# EAGLE design sensorHubRev6 (EAGLE 9.2.2)
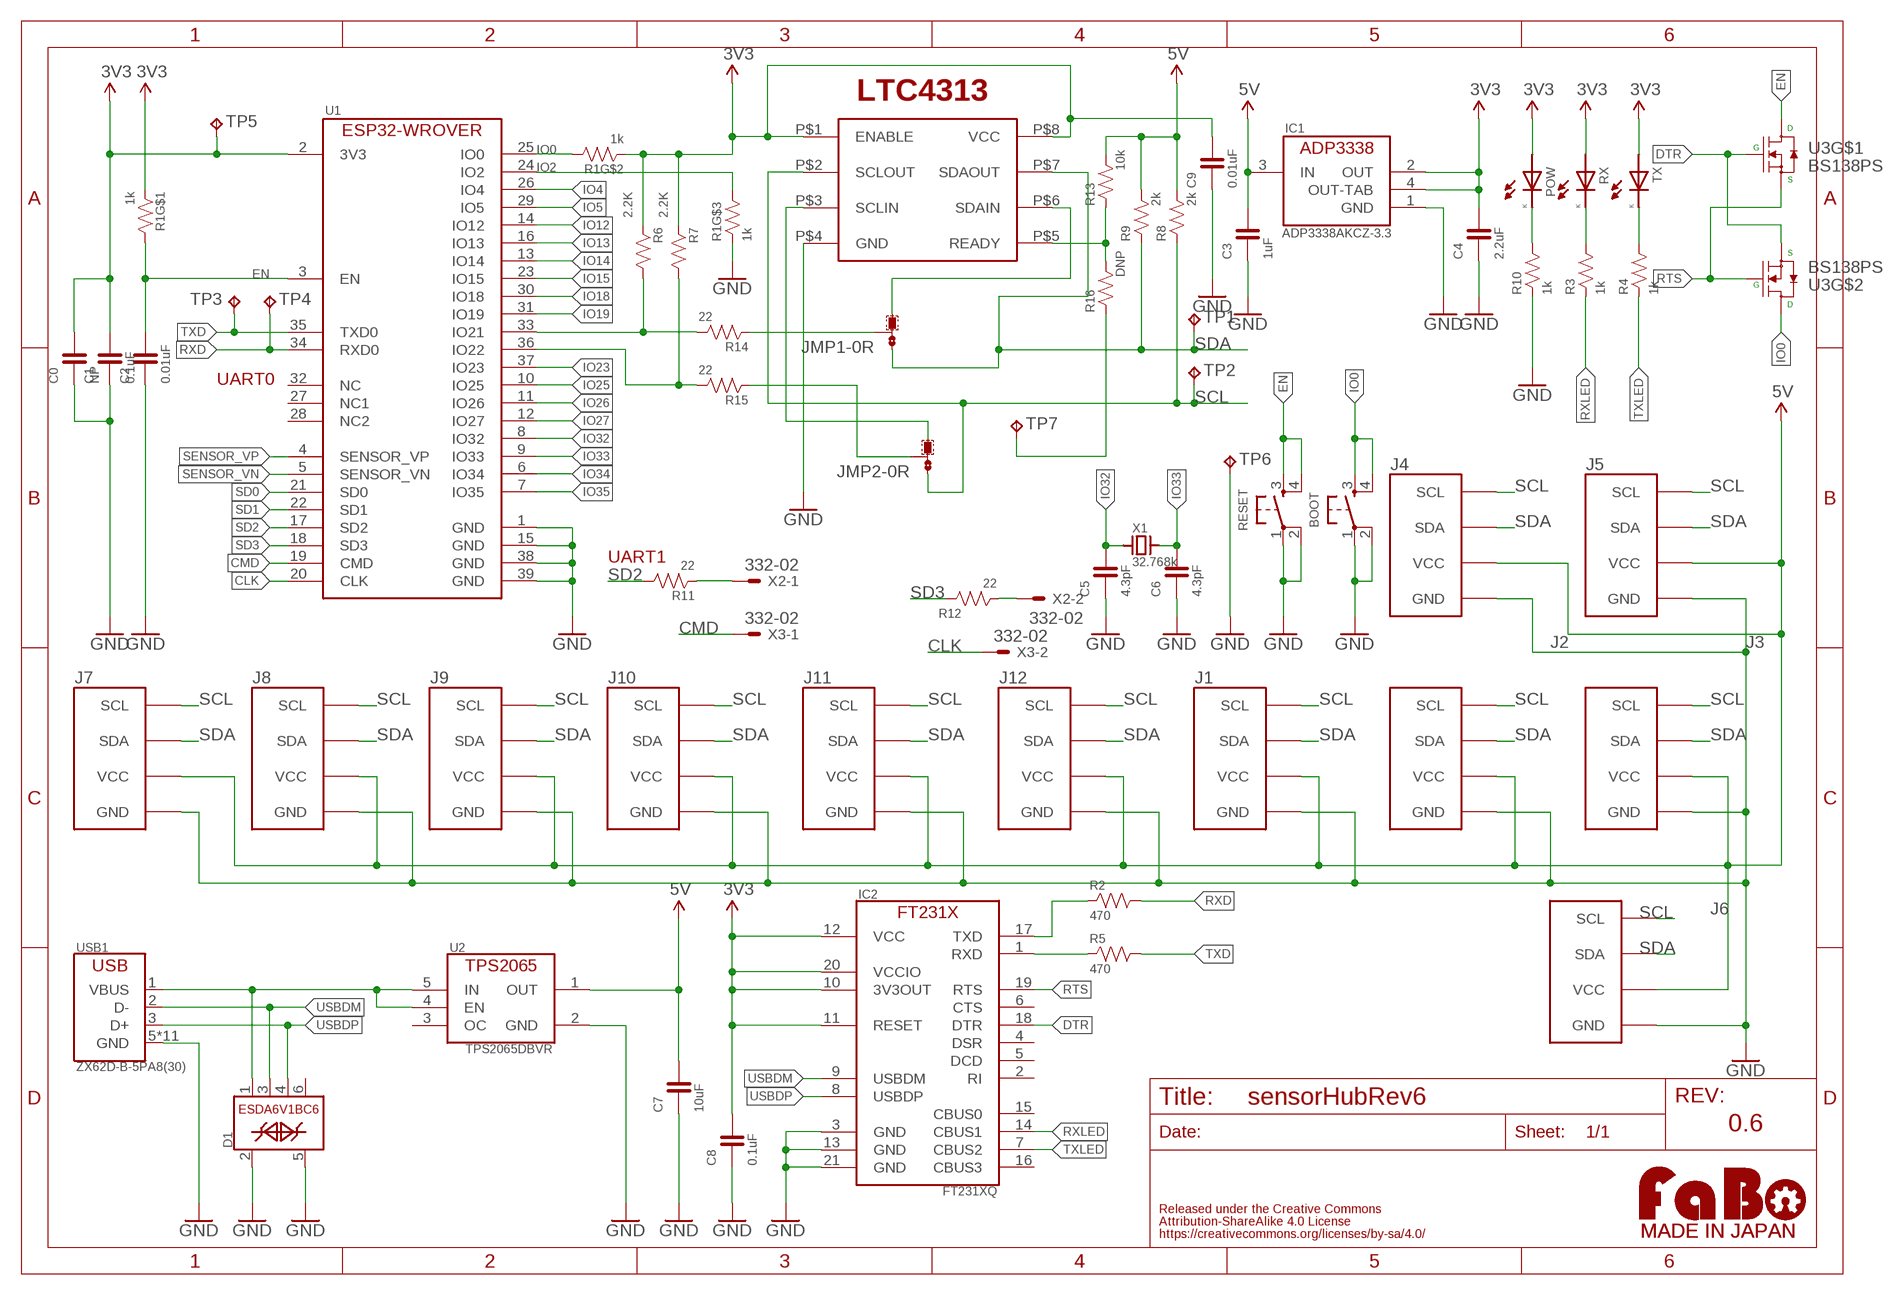
[diagram p0: schematic, sheet 1]

## Parts
BOOT  TACTILE-KMR2  [KMR2-TACT]
C0  NP  CAPACITOR-M  [MULTIPAD0603]
C1  0.1uF  CAPACITOR-0603  [EIA0603]
C2  0.01uF  CAPACITOR-0603  [EIA0603]
C3  1uF  CAPACITOR-0603  [EIA0603]
C4  2.2uF  CAPACITOR-0603  [EIA0603]
C5  4.3pF  CAPACITOR-0603  [EIA0603]
C6  4.3pF  CAPACITOR-0603  [EIA0603]
C7  10uF  CAPACITOR-0603  [EIA0603]
C8  0.1uF  CAPACITOR-0603  [EIA0603]
C9  0.01uF  CAPACITOR-0603  [EIA0603]
D1  ESDA6V1BC6  [SOT-23-6L]
IC1  ADP3338AKCZ-3.3  ADP3338AKCZ  [SOT-223-KC3]
IC2  FT231XQ  [QFN-20]
J1  FABO_BRICK_I2C-S04B-PASK-2  [FABO_BRICK_I2C_S04B-PASK-2]
J2  FABO_BRICK_I2C-S04B-PASK-2  [FABO_BRICK_I2C_S04B-PASK-2]
J3  FABO_BRICK_I2C-S04B-PASK-2  [FABO_BRICK_I2C_S04B-PASK-2]
J4  FABO_BRICK_I2C-S04B-PASK-2  [FABO_BRICK_I2C_S04B-PASK-2]
J5  FABO_BRICK_I2C-S04B-PASK-2  [FABO_BRICK_I2C_S04B-PASK-2]
J6  FABO_BRICK_I2C-S04B-PASK-2  [FABO_BRICK_I2C_S04B-PASK-2]
J7  FABO_BRICK_I2C-S04B-PASK-2  [FABO_BRICK_I2C_S04B-PASK-2]
J8  FABO_BRICK_I2C-S04B-PASK-2  [FABO_BRICK_I2C_S04B-PASK-2]
J9  FABO_BRICK_I2C-S04B-PASK-2  [FABO_BRICK_I2C_S04B-PASK-2]
J10  FABO_BRICK_I2C-S04B-PASK-2  [FABO_BRICK_I2C_S04B-PASK-2]
J11  FABO_BRICK_I2C-S04B-PASK-2  [FABO_BRICK_I2C_S04B-PASK-2]
J12  FABO_BRICK_I2C-S04B-PASK-2  [FABO_BRICK_I2C_S04B-PASK-2]
JMP1  0R-JUMPA  [A0R-JMP]
JMP2  0R-JUMPA  [A0R-JMP]
LOGO1  LOGO_FABO-M_BOTTOM  [LOGO_FABO_M_BOTTOM]
POW  LED-0603  [LED_0603]
R1  1k  RESISTOR_ARRAY  [EXBV8V]
R2  470  RESISTOR-0603  [EIA0603]
R3  1k  RESISTOR-0603  [EIA0603]
R4  1k  RESISTOR-0603  [EIA0603]
R5  470  RESISTOR-0603  [EIA0603]
R6  2.2K  RESISTOR-0603  [EIA0603]
R7  2.2K  RESISTOR-0603  [EIA0603]
R8  2k  RESISTOR-0603  [EIA0603]
R9  2k  RESISTOR-0603  [EIA0603]
R10  1k  RESISTOR-0603  [EIA0603]
R11  22  RESISTOR-0603  [EIA0603]
R12  22  RESISTOR-0603  [EIA0603]
R13  10k  RESISTOR-0603  [EIA0603]
R14  22  RESISTOR-0603  [EIA0603]
R15  22  RESISTOR-0603  [EIA0603]
R16  DNP  RESISTOR-0603  [EIA0603]
RESET  TACTILE-KMR2  [KMR2-TACT]
RX  LED-0603  [LED_0603]
TP1  TPB1,27  [B1,27]
TP2  TPB1,27  [B1,27]
TP3  TPB1,27  [B1,27]
TP4  TPB1,27  [B1,27]
TP5  TPB1,27  [B1,27]
TP6  TPB1,27  [B1,27]
TP7  TPB1,27  [B1,27]
TX  LED-0603  [LED_0603]
U1  ESP32-WROVER-B  [ESP32-WROVER-B]
U2  TPS2065DBVR  TPS2065DBV  [SOT-23-5]
U3  BS138PS  [SOT-363]
U5  LTC4313  [LTC4313]
USB1  ZX62D-B-5PA8(30)  USB-ZX62D  [ZX62D-B-5PA8]
X1  32.768k  CRYSTAL-ABS07  [ABS07]
X2  332-02  [332-02]
X3  332-02  [332-02]

## Nets
3V3: C0.2 C1.2 C4.2 C8.2 C9.2 IC1.2(OUT) IC1.4(OUT-TAB) IC2.10(3V3OUT) IC2.11(RESET) IC2.12(VCC) IC2.20(VCCIO) POW.A(ANODE) R1.1 R1.2 R6.1 R7.1 RX.A(ANODE) TP5.TP TX.A(ANODE) U1.2(3V3) U5.P$1(ENABLE) U5.P$8(VCC)
5V: C3.2 C7.2 IC1.3(IN) J1.VCC J2.VCC J3.VCC J4.VCC J5.VCC J6.VCC J7.VCC J8.VCC J9.VCC J10.VCC J11.VCC J12.VCC R8.2 R9.2 R13.2 U2.1(OUT)
CLK: U1.20(CLK) X3.2
CMD: U1.19(CMD) X3.1
DTR: IC2.18(DTR) U3.2(G) U3.4(S)
EN: C2.2 R1.8 RESET.3 RESET.4 U1.3(EN) U3.6(D)
GND: BOOT.1 BOOT.2 C0.1 C1.1 C2.1 C3.1 C4.1 C5.1 C6.1 C7.1 C8.1 C9.1 D1.2 D1.5 IC1.1(GND) IC2.3(GND) IC2.13(GND) IC2.21(GND) J1.GND J2.GND J3.GND J4.GND J5.GND J6.GND J7.GND J8.GND J9.GND J10.GND J11.GND J12.GND R1.3 R10.1 RESET.1 RESET.2 TP6.TP U1.1(GND) U1.15(GND) U1.38(GND) U1.39(GND) U2.2(GND) U5.P$4(GND) USB1.5(GND) USB1.B1(GND) USB1.B2(GND) USB1.B3(GND) USB1.B4(GND) USB1.T1(GND) USB1.T2(GND) USB1.T3(GND) USB1.T4(GND) USB1.T5(GND) USB1.T6(GND)
IO0: BOOT.3 BOOT.4 R1.7 U1.25(IO0) U3.3(D)
IO2: R1.6 U1.24(IO2)
IO4: U1.26(IO4)
IO5: U1.29(IO5)
IO12: U1.14(IO12)
IO13: U1.16(IO13)
IO14: U1.13(IO14)
IO15: U1.23(IO15)
IO18: U1.30(IO18)
IO19: U1.31(IO19)
IO23: U1.37(IO23)
IO25: U1.10(IO25)
IO26: U1.11(IO26)
IO27: U1.12(IO27)
IO32: C5.2 U1.8(IO32) X1.1
IO33: C6.2 U1.9(IO33) X1.2
IO34: U1.6(IO34)
IO35: U1.7(IO35)
LED1K: POW.K(CATHODE) R10.2
LED2K1: R3.2 RX.K(CATHODE)
LED2K2: R4.2 TX.K(CATHODE)
N$1: IC2.1(RXD) R5.1
N$2: R11.1 X2.1
N$3: IC2.17(TXD) R2.1
N$4: R12.1 X2.2
N$5: JMP1.3 U5.P$6(SDAIN)
N$6: JMP2.3 U5.P$3(SCLIN)
N$7: R13.1 R16.2 U5.P$5(READY)
N$8: JMP1.2 R14.1
N$9: JMP2.2 R15.1
N$10: R6.2 R14.2 U1.33(IO21)
N$11: R16.1 TP7.TP
N$12: R7.2 R15.2 U1.36(IO22)
RTS: IC2.19(RTS) U3.1(S) U3.5(G)
RXD: R2.2 TP4.TP U1.34(RXD0)
RXLED: IC2.14(CBUS1) R3.1
SCL: J1.SCL J2.SCL J3.SCL J4.SCL J5.SCL J6.SCL J7.SCL J8.SCL J9.SCL J10.SCL J11.SCL J12.SCL JMP2.1 R8.1 TP2.TP U5.P$2(SCLOUT)
SD0: U1.21(SD0)
SD1: U1.22(SD1)
SD2: R11.2 U1.17(SD2)
SD3: R12.2 U1.18(SD3)
SDA: J1.SDA J2.SDA J3.SDA J4.SDA J5.SDA J6.SDA J7.SDA J8.SDA J9.SDA J10.SDA J11.SDA J12.SDA JMP1.1 R9.1 TP1.TP U5.P$7(SDAOUT)
SENSOR_VN: U1.5(SENSOR_VN)
SENSOR_VP: U1.4(SENSOR_VP)
TXD: R5.2 TP3.TP U1.35(TXD0)
TXLED: IC2.7(CBUS2) R4.1
USBDM: D1.3 IC2.9(USBDM) USB1.2(D-)
USBDP: D1.4 IC2.8(USBDP) USB1.3(D+)
USBVBUS: D1.1 U2.4(EN) U2.5(IN) USB1.1(VBUS)
Unconnected: D1.6 IC2.2(RI) IC2.4(DSR) IC2.5(DCD) IC2.6(CTS) IC2.15(CBUS0) IC2.16(CBUS3) R1.4 R1.5 U1.27(NC1) U1.28(NC2) U1.32(NC) U2.3(OC)

## Notes on the sheet
- UART0
- UART1
- 0.6

## Library data of the parts
BOOT RESET = component:TACTILE
C0 C1-C9 = component:CAPACITOR
D1 = component:ESDA6V1BC6
IC1 = component:ADP3338AKCZ
IC2 = component:FT231X
J1-J12 = FaBo-Template:FABO_BRICK_I2C: FaBo Brick I2C
JMP1 JMP2 = jump-0r-smd:0R-JUMP: SMD 0R 0805 Jumper
LOGO1 = component:LOGO_FABO
POW RX TX = component:LED
R1 = component:RESISTOR_ARRAY
R2-R16 = component:RESISTOR
TP1-TP7 = testpad:TP: Test pad
U1 = component:ESP32-WROVER-B
U2 = component:TPS2065
U3 = component:BS138PS
U5 = FaBo-LevelTranslator:LTC4313
USB1 = component:USB
X1 = component:CRYSTAL
X2 X3 = con-garry:332-02: 2 Pin - 2mm Dual Row Source: www.mpe-connector.de / garry_shortform_2012.pdf

## Board
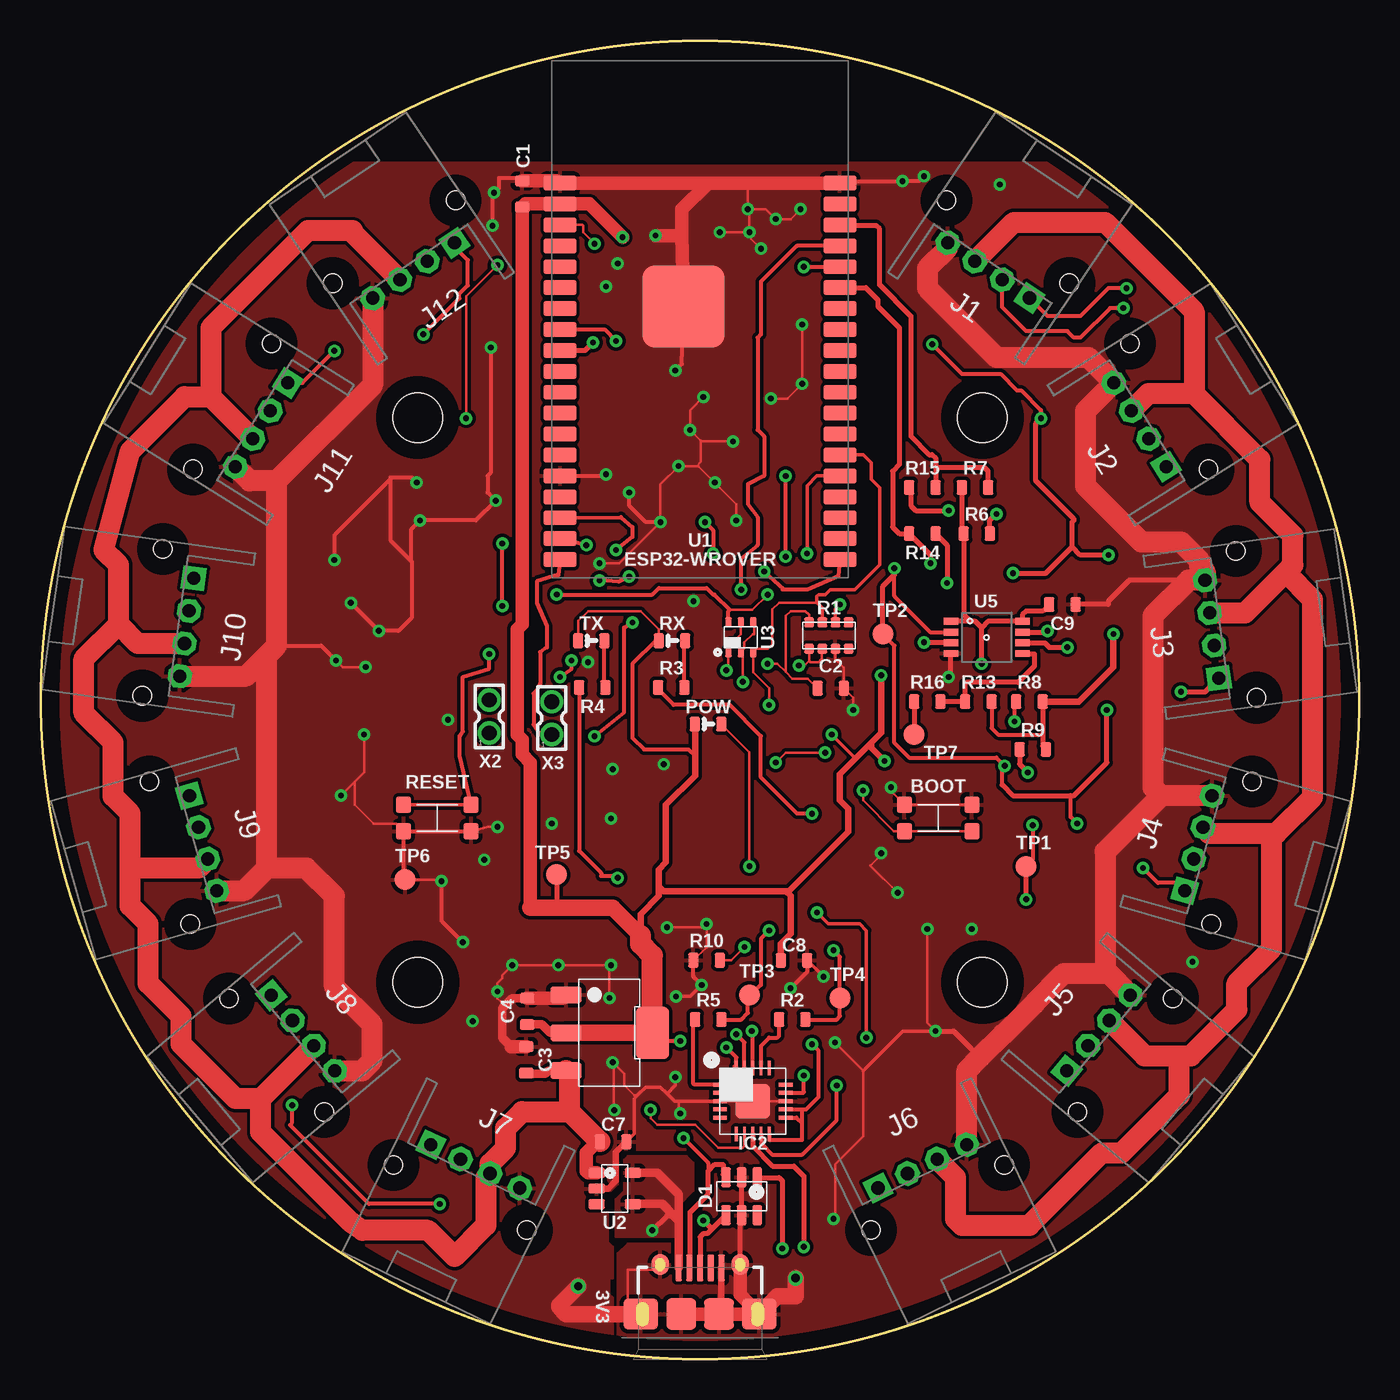
[diagram p1: board, top side]
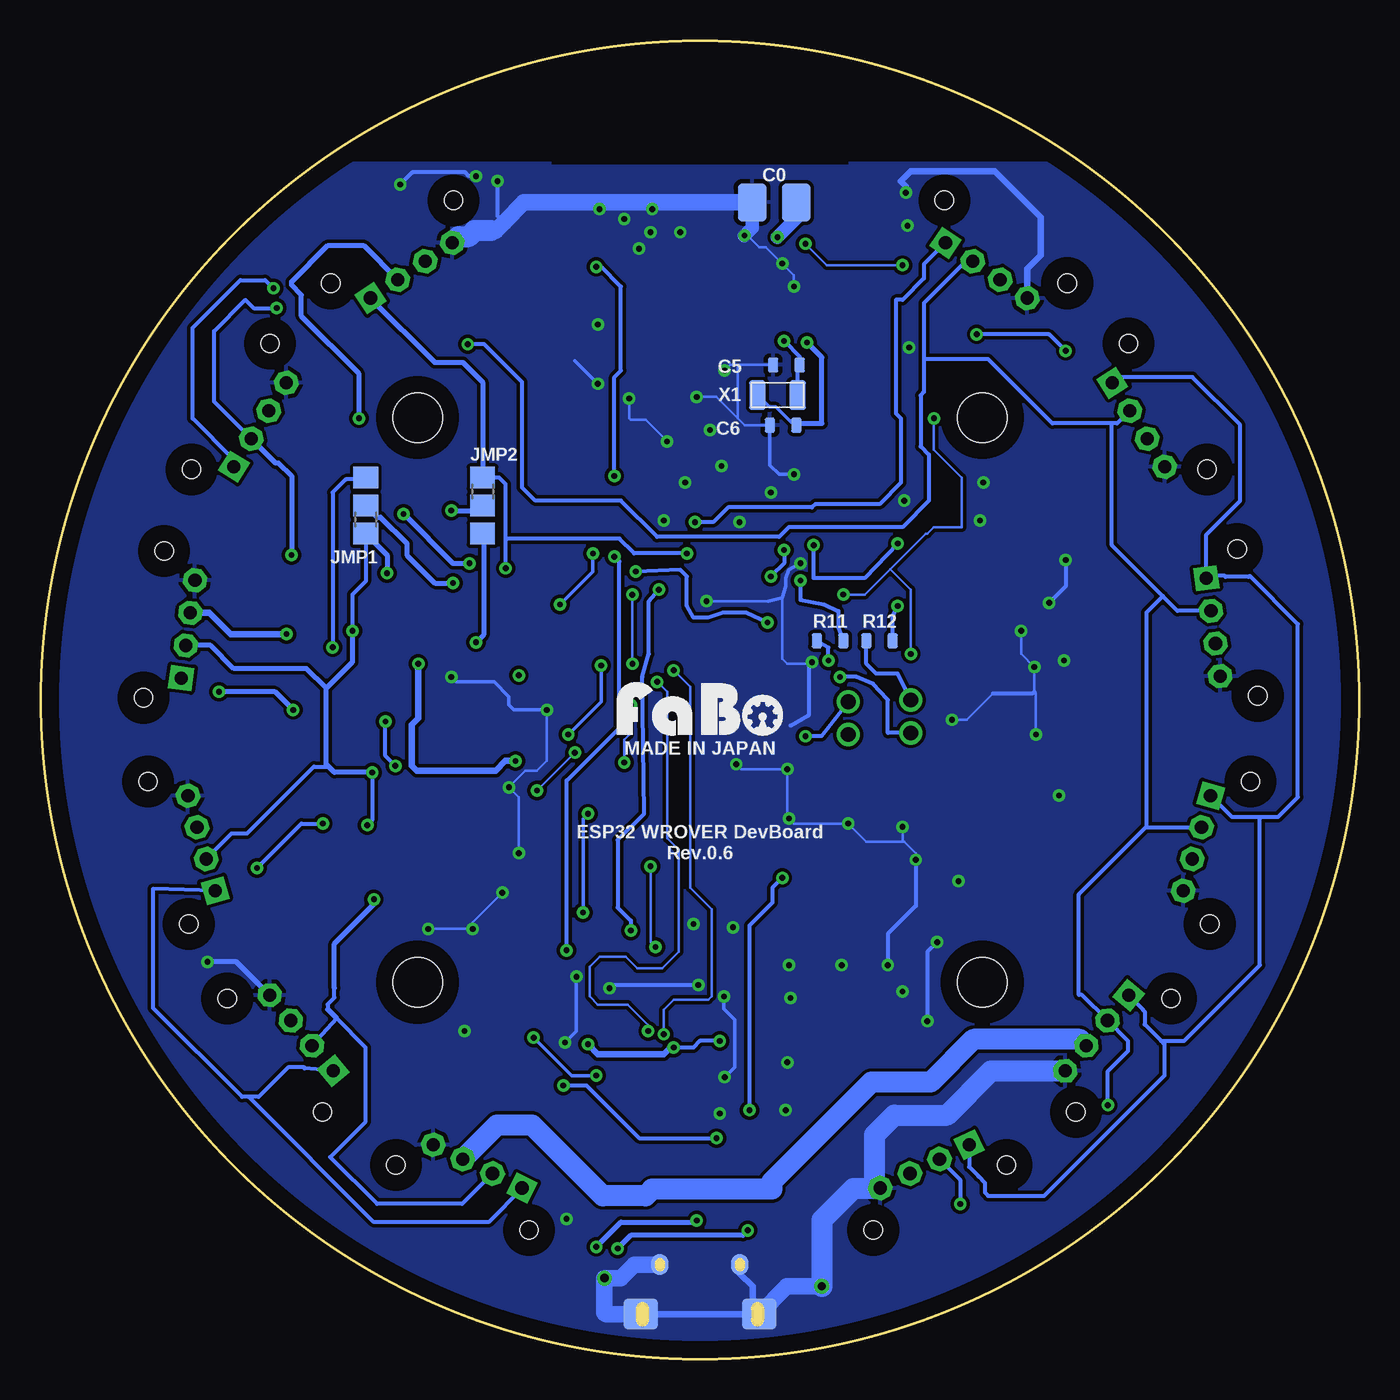
[diagram p2: board, bottom side, seen from below]

Size 80 x 80 mm. Coordinates in mm from the lower left corner, seen from the top.
Outline: circle at 40,40 radius 40
Copper layers (1*16): Top 0.035mm / dielectric 1.5mm / Bottom 0.035mm
Design rules "PCBway": minimum track width 6mil, minimum drill 0.3mm, track to track 0.205mm, track to pad 0.205mm, pad to pad 0.205mm, via to via 0.205mm, smd to smd 8mil, copper to edge 40mil, drill to drill 8mil, minimum pad ring 10mil, minimum via ring 8mil, stop-mask expansion 4mil, vias tented up to drill 25mil, thermal gap 10mil
Holes 3 mm at 22.86,57.15 22.86,22.86 57.15,22.86 57.15,57.15
tRestrict: area 15.5,72.7 to 65.1,83.6
bRestrict: area 15.5,72.7 to 65.1,83.6

### Footprints (pad centres in the part's own frame; a part is rotated, then mirrored left to right if it is on the bottom)
KMR2-TACT = smd 0.9 x 1: 1 -2.05,0.8; 2 2.05,0.8; 3 2.05,-0.8; 4 -2.05,-0.8
MULTIPAD0603 = smd 1.725 x 2.3: 1 -1.337,0; 2 1.337,0
EIA0603 = smd 0.65 x 0.9: 1 -0.8,0; 2 0.8,0
SOT-23-6L = smd 0.6 x 1.2: 1 -0.95,-1.15; 2 0,-1.15; 3 0.95,-1.15; 4 0.95,1.15; 5 0,1.15; 6 -0.95,1.15
SOT-223-KC3 = smd 1 x 1.9: 1 -2.3,-2.625; 2 0,-2.625; 3 2.3,-2.625 | smd 3.15 x 2: 4 0,2.625
QFN-20 = smd 0.9 x 0.25: 1 -2,1; 2 -2,0.5; 3 -2,0; 4 -2,-0.5; 5 -2,-1; 11 2,-1; 12 2,-0.5; 13 2,0; 14 2,0.5; 15 2,1 | smd 0.25 x 0.9: 6 -1,-2; 7 -0.5,-2; 8 0,-2; 9 0.5,-2; 10 1,-2; 16 1,2; 17 0.5,2; 18 0,2; 19 -0.5,2; 20 -1,2 | smd 2.1 x 2.1: 21 0,0
FABO_BRICK_I2C_S04B-PASK-2 = drill 0.8 pad 1.422 octagon: GND -3,0; SDA 1,0; VCC -1,0 | drill 0.8 pad 1.422 square: SCL 3,0 | hole 1.1: 4.5,2.1; -4.5,2.1
A0R-JMP = smd 1.5 x 1.3: 1 0,1.7; 2 0,0; 3 0,-1.7
LED_0603 = smd 0.65 x 0.9: A -0.8,0; K 0.8,0
EXBV8V = smd 0.6 x 0.6: 1 -1.2,-0.8; 2 -0.4,-0.8; 3 0.4,-0.8; 4 1.2,-0.8; 5 1.2,0.8; 6 0.4,0.8; 7 -0.4,0.8; 8 -1.2,0.8
B1,27 = smd 1.27 x 1.27: TP 0,0
ESP32-WROVER-B = smd 2 x 0.9: 1 -8.5,8.26; 2 -8.5,6.99; 3 -8.5,5.72; 4 -8.5,4.45; 5 -8.5,3.18; 6 -8.5,1.91; 7 -8.5,0.64; 8 -8.5,-0.63; 9 -8.5,-1.9; 10 -8.5,-3.17; 11 -8.5,-4.44; 12 -8.5,-5.71; 13 -8.5,-6.98; 14 -8.5,-8.25; 15 -8.5,-9.52; 16 -8.5,-10.79; 17 -8.5,-12.06; 18 -8.5,-13.33; 19 -8.5,-14.6; 20 8.5,-14.6; 21 8.5,-13.33; 22 8.5,-12.06; 23 8.5,-10.79; 24 8.5,-9.52; 25 8.5,-8.25; 26 8.5,-6.98; 27 8.5,-5.71; 28 8.5,-4.44; 29 8.5,-3.17; 30 8.5,-1.9; 31 8.5,-0.63; 32 8.5,0.64; 33 8.5,1.91; 34 8.5,3.18; 35 8.5,4.45; 36 8.5,5.72; 37 8.5,6.99; 38 8.5,8.26 | smd 5 x 5: 39 -1,0.76
SOT-23-5 = smd 0.6 x 1: 1 -0.95,-1.1; 2 0,-1.1; 3 0.95,-1.1; 4 0.95,1.1; 5 -0.95,1.1
SOT-363 = smd 0.6 x 0.4: 1 -0.9,0.75; 2 -0.9,0; 3 -0.9,-0.75; 4 0.9,-0.75; 5 0.9,0; 6 0.9,0.75
LTC4313 = smd 0.42 x 0.889: P$1 -0.975,-2.171; P$2 -0.325,-2.171; P$3 0.325,-2.171; P$4 0.975,-2.171; P$5 0.975,2.171; P$6 0.325,2.171; P$7 -0.325,2.171; P$8 -0.975,2.171
ZX62D-B-5PA8 = smd 0.4 x 1.6: 1 -1.3,4.25; 2 -0.65,4.25; 3 0,4.25; 4 0.65,4.25; 5 1.3,4.25 | smd 1.05 x 1.25 bottom: B1 -2.425,4.45; B2 2.425,4.45 | smd 2.1 x 1.9 bottom: B3 -3.6,1.45; B4 3.6,1.45 | smd 1.05 x 1.25: T1 -2.425,4.45; T2 2.425,4.45 | smd 2.1 x 1.9: T3 -3.6,1.45; T6 3.6,1.45 | smd 1.8 x 1.9: T4 -1.15,1.45; T5 1.15,1.45
ABS07 = smd 1 x 1.8: 1 -1.225,0; 2 1.225,0
332-02 = drill 0.9 pad 1.27: 1 0,-1; 2 0,1

### Placement (x,y rotation side)
BOOT  54.46,32.84 0 top
C0  35.49,70.21 0 bottom
C1  29.21,70.72 270 top
C2  47.94,40.71 180 top
C3  29.45,18.15 270 top
C4  29.5,21.09 270 top
C5  34.76,60.34 0 bottom
C6  34.95,56.68 0 bottom
C7  34.73,13.18 180 top
C8  45.7,24.19 180 top
C9  62,45.8 180 top
D1  42.53,9.88 180 top
IC1  34.49,19.8 270 top
IC2  43.2,15.64 0 top
J1  57.52,66.08 326 top
J2  66.71,56.71 302 top
J3  71.08,44.3 278 top
J4  70.26,31.31 254 top
J5  64.2,19.78 230 top
J6  53.5,11.69 206 top
J7  26.36,11.69 154 top
J8  15.9,19.78 130 top
J9  9.83,31.31 106 top
J10  8.84,44.42 82 top
J11  13.38,56.71 58 top
J12  22.61,66.08 34 top
JMP1  60.3,51.8 180 bottom
JMP2  53.2,51.8 0 bottom
LOGO1  40.01,37.47 0 top
POW  40.49,38.53 0 top
R1  47.83,43.91 0 top
R2  45.6,20.6 0 top
R3  38.26,40.76 0 top
R4  33.46,40.76 0 top
R5  40.5,20.6 0 top
R6  56.8,50.1 0 top
R7  56.7,52.9 0 top
R8  60,39.9 0 top
R9  60.2,37 0 top
R10  40.4,24.2 0 top
R11  32.1,43.6 0 bottom
R12  29.1,43.6 0 bottom
R13  56.9,39.9 0 top
R14  53.5,50.1 180 top
R15  53.5,52.9 0 top
R16  53.8,39.9 0 top
RESET  24.05,32.84 180 top
RX  38.3,43.6 0 top
TP1  59.8,29.9 0 top
TP2  51.1,44 0 top
TP3  43,22.1 0 top
TP4  48.5,21.9 0 top
TP5  31.3,29.4 0 top
TP6  22.1,29.1 0 top
TP7  53,37.9 0 top
TX  33.4,43.6 0 top
U1  40,63.12 0 top
U2  34.83,10.34 270 top
U3  42.48,43.81 90 top
U5  57.4,43.8 270 top
USB1  40.01,1.27 0 top
X1  35.3,58.51 180 bottom
X2  27.2,39 0 top
X3  31,38.9 0 top

### Tracks (layer width: path | path; a pad name or v marks a point on that pad's centre or on a via)
3V3  (via drill 0.35)
  Top 0.152: TX.A 32.6,44.8 33.2,45.4 36.4,45.4 37.5,44.3 RX.A 37.5,43.3 | R1.1 46.62,42.38 | 46.62,42.38 46.7,42.3 47.2,42.3 47.4,42.5 47.4,43.09 R1.2 | 46.62,42.38 46.35,42.1 v46,42.1
  Top 0.203: v48,37.9 49.4,36.5 49.5,36.5
  Top 0.254: IC1.4 37.61,19.3 v38.8,19.3 | 42.1,17.75 IC2.20 42.2,18.3 v41.6,18.9 | IC2.12 46.3,15.14 | 46.3,15.14 46.45,15.14 47.2,15.9 47.2,18.7 v46.8,19.1 | IC2.10 44.2,13.3 46.2,13.3 46.2,14.3 | 46.2,14.3 46.2,15.04 46.3,15.14 | IC2.11 45.85,14.64 46.2,14.3 | RX.A 37.3,43.6 35.9,42.2 35.9,37.7 36.6,37 39.3,37 39.7,36.6
  Top 0.305: 31.5,29.6 TP5.TP 31.3,27.5 31.4,27.4 | v57.1,42.2 57.1,44.4 | 57.1,44.4 56.73,44.77 56.4,44.77 | 56.4,44.77 U5.P$1 | 57.1,44.4 57.48,44.77 U5.P$8 59.57,45.17 59.8,45.4 60.8,45.4 C9.2 | R7.1 55.9,50.2 R6.1 56,45.17 56.4,44.77
  Top 0.406: 45.01,24.19 C8.2 44.91,24.89 44.9,24.9 44.9,25.2 45.5,25.8 45.5,28.1 45.2,28.4 | 37.5,28.7 37.5,29.7 37.94,30.14 37.94,33.63 39.7,35.4 39.7,36.6 POW.A | 37.5,28.7 37.5,28.1 36.4,27 36.4,25.7 | 45.2,28.4 37.8,28.4 37.5,28.7 | 45.2,28.4 45.4,28.4 49,32 49,33.4 48.5,33.9 48.5,35.5 49.5,36.5 50.4,37.4 | v51,41.5 51,38 50.4,37.4 | v51.2,36.3 50.4,37.1 50.4,37.4
  Top 0.508: IC1.2 30.91,19.8 30.4,20.3 C4.2
  Top 0.813: v35.3,68.1 33.28,70.11 U1.2 29.41,70.11 C1.2 29.2,44.6 28.9,44.3 28.9,37.9 29.2,37.6 29.2,36.7 29.7,36.2 29.7,27.4
  Top 1.016: IC1.4 IC1.2 | 29.7,27.4 31.4,27.4 34.7,27.4 36.4,25.7
  Top 1.27: IC1.4 37.12,24.48 36.4,25.2 36.4,25.7
  Bottom 0.203: v46,42.1 46,39.9 v48,37.9
  Bottom 0.254: v38.8,19.3 40,19.3 40.4,18.9 v41.6,18.9
  Bottom 0.406: v41.6,18.9 41.8,18.9 42.2,18.5 46.2,18.5 v46.8,19.1 | v57.1,42.2 57.1,38.9 57.5,38.5 57.5,36 57.2,35.7 52.41,35.7 51.81,36.3 v51.2,36.3
  Bottom 0.813: v35.3,68.1 34.16,69.24 C0.2
5V  (via drill 0.35)
  Top 0.254: R13.2 57.7,38.3 58.1,37.9 60.8,37.9
  Top 0.305: R8.2 60.8,37.9 60.8,37.2 R9.2
  Top 0.406: R8.2 63,39.9 65.1,42 v65.1,44
  Top 0.508: 31.9,17.46 IC1.3 30.8,17.5 30.6,17.3 29.5,17.3 C3.2
  Top 0.813: 31.7,17.33 IC1.3 | U2.1 33.21,11.29 33.1,11.4 33.1,12.5 33.78,13.18 C7.2
  Top 1.27: C7.2 32.1,15.01 | IC1.3 32.1,17.26 32.1,15.01 | J3.VCC 73.09,45.29 75.55,47.75 | 75.55,47.75 76,48.2 76,50 74,52 74,54.6 70,58.6 | J2.VCC 67.22,58.6 70,58.6 | J1.VCC 59.05,69 64.6,69 70,63.6 70,58.6 | J4.VCC 70.91,31.9 75,31.9 | 75,31.9 77.2,34.1 77.2,46.1 75.55,47.75 | J5.VCC 66.99,18.4 68.9,18.4 | 68.9,18.4 69.8,18.4 72.6,21.2 72.6,22.8 74.7,24.9 74.7,31.6 75,31.9 | J6.VCC 55.5,11.02 55.5,8.5 55.9,8.1 60,8.1 64.4,12.5 65.6,12.5 69.1,16 69.1,18.2 68.9,18.4 | J12.VCC 18.9,68.4 18.9,68.5 16.2,68.5 10.3,62.6 10.3,58.41 | 10.3,58.41 J11.VCC | J10.VCC 5.87,43.43 4.7,44.6 | 4.7,44.6 4.7,48.2 3.8,49.1 5.41,55.11 8.71,58.41 10.3,58.41 | J9.VCC 9.56,29.8 5.4,29.8 | 5.4,29.8 5.4,33.12 4.37,34.15 4.37,37.43 2.6,39.2 2.6,42.5 4.7,44.6 | J8.VCC 13.33,15.8 | 5.4,29.8 5.4,27.5 6.5,26.4 6.5,22.8 8.5,20.8 8.5,19.1 11.8,15.8 13.33,15.8 | 13.33,15.8 13.33,13.77 18.8,8.3 19.51,7.8 23.5,7.8 25.1,6.2 27,8.1 27,10.99 J7.VCC 27.25,11.85 28.2,12.8 28.2,14 29.2,15.01 32.1,15.01
  Bottom 0.406: v65.1,44 68.5,44 69.79,45.29 J3.VCC
  Bottom 1.27: J6.VCC 52.32,14.2 50.2,14.2 45.9,9.9 43.3,9.9 42.9,10.3 35.64,10.3 35.64,10.76 29.6,16.8 26,16.8 23.4,19.4 16.93,19.4 J8.VCC
CLK  (via drill 0.35)
  Top 0.254: U1.20 48.4,47.5 46.5,46.7 45.1,46.7 | 45.1,46.7 45,46.7 | 45.1,46.7 v43.9,47.8 | v33.59,37.8 35.4,39.26 35.4,44.4 v35.9,44.7
  Bottom 0.254: X3.2 32.63,37.8 v33.59,37.8 | v35.9,44.7 37.2,45.3 38.6,45.3 39.5,45 40.4,45 40.8,45.7 40.8,47.5 41.2,47.9 v43.9,47.8
CMD
  Top 0.254: U1.19 31.4,47.6 30.1,47.2 30.1,45.9 30.7,44.5 30.7,43.2 30.3,42.9 30.3,41 30.1,40.6 29.9,40.4 29.9,38.5 30.3,37.9 X3.1
DTR  (via drill 0.35)
  Top 0.152: 43.2,19.84 v43.15,19.9 | v42.6,41.1 42.6,42.79 U3.2 42.7,43.13 42.7,43.5 43.2,44 43.3,44 43.3,44.64 U3.4
  Top 0.254: IC2.18 43.2,19.84
  Bottom 0.152: v43.15,19.9 43.15,20.25 44.4,21.5 46.2,21.5 46.7,22 46.7,23.8 46.1,24.4 44.5,24.4 43.8,23.7 42.3,23.7 41.3,24.7 41.3,30.9 42,31.6 42,40.5 v42.6,41.1
EN  (via drill 0.35)
  Top 0.152: v25.8,57.1 25.8,64.5 v27.7,66.4 | v33.6,67.7 32.9,68.4 32.9,68.8 32.85,68.84 U1.3 | C2.2 46.55,41.3 45.6,41.3 45.2,41.7 | R1.8 46.62,45.17 46.4,45.4 45.5,45.4 45.2,45.1 45.2,41.7 | 45.2,41.7 44.7,42.2 v44.1,42.2 | v44.11,46.39 43.18,45.47 41.8,45.47 41.73,45.47
  Top 0.203: RESET.3 RESET.4
  Top 0.254: RESET.4 25.4,36.6 25.4,37.8 25.6,38.1 25.6,41.4 27.2,41.9 v27.2,42.8 | v31.3,46.4 37.1,46.4 37.5,46.8 40.4,46.8 40.8,46.4 40.87,46.4 41.8,45.47 41.73,45.4 U3.6
  Bottom 0.152: v31.3,46.4 30,46.4 28.45,47.95 | v25.8,57.1 25.8,55.2 24.1,53.5 24.1,50.5 25.8,50.5 26.2,50.1 26.3,50.1 28.45,47.95 | v27.7,66.4 32.3,66.4 v33.6,67.7 | v27.2,42.8 27.2,46.7 28.45,47.95 | v44.1,42.2 v44.1,46.39 v44.11,46.39
GND  (via drill 0.35, 0.5)
  Top 0.152: BOOT.2 BOOT.1 51.6,34.45 v51.6,34.7 | R1.3 48.23,42.48 48.74,41.96 C2.1 49.3,40.15 v49.3,39.4 | v19.6,37.9 19.6,35.6 19.05,35.05 | USB1.T3 35.6,3.52 35.6,5.4 37.26,5.4 USB1.T1 | IC2.3 IC2.21 IC2.13 | v41.2,68.4 v43,68.4 | v43,68.4 43,69.7 v42.9,69.8 | v42.9,69.8 42.9,71.39 | v42.9,69.8 44,69.8 v44.6,69.2 45.5,69.2 v46.1,69.8 | v43,68.4 43,68.1 v43.7,67.4 | v46.2,62.8 v46.2,59.2 45.3,58.3 v44.3,58.3 | v42,55.7 40.1,55.7 40.05,55.75 | 40.05,55.75 v39.4,56.4 39.4,57.6 v40.2,58.4 | 39.8,54.2 v38.7,54.2 37.6,53.1 v37.6,50.8 35.1,48.3 v33.9,48.3 | 39.8,54.2 39.9,54.2 v40.9,53.2 42.2,51.9 v42.2,50.9 | 39.8,54.2 40.05,54.45 40.05,55.75 | RESET.1 27.14,32.3 v27.7,32.3 | v24.3,29 24.2,29.1 TP6.TP | v18.2,34.2 19.05,35.05 | v17.9,42.4 18.3,42 v19.7,42 | v52,28.3 50.35,29.95 51,30.6 v51,30.7 | R10.1 40.4,25 v40.4,26.4 40.2,26.2 v38,26.2 | v34.5,21.9 34.5,23.8 v34.6,23.9 v31.4,23.9 v28.6,23.9 28,23.3 28,23.1 27.7,22.8 v27.7,22.3 27.7,21.9 28,21.6 28,21.3 | v34.7,18 34.75,17.95 | 34.75,17.95 35.4,17.3 35.4,16.6 36,16 36.2,16 | v34.8,15.1 34.75,15.15 34.75,17.95 | v48.2,19.2 49.9,17.5 49.9,13.5 48.2,11.8 48.2,8.6 v48.1,8.5 | v54.3,19.9 53.8,20.4 v53.8,26.1 | v38.8,14.9 38.7,15 38.7,15.64 | RESET.2 21.55,32.5 20.2,32.5 19.05,33.65 19.05,35.05
  Top 0.203: C7.1 36,13.65 36,15.8 36.2,16 36.7,16.5 37.6,16.5 38,16.1 | IC2.3 38.7,15.64 38.45,15.64 38,16.1 | v40.1,22.7 39.4,22 v38.54,22 | v38.5,17.1 38.5,16.6 38,16.1 | v47.5,23.2 46.6,24.1 46.51,24.1 | 49.9,17.5 52.3,19.9 v54.3,19.9
  Top 0.254: U1.15 34.2,53.6 v34.3,53.7 | v38.5,60 38.91,60.41 U1.39 | 30.82,71.39 U1.1 | TP6.TP 22,29.2 RESET.2 RESET.1 | USB1.T2 42.73,5.42 | C8.1 46.51,24.1 46.51,23.5 v45.5,22.5 | v40.1,22.7 39.6,23.2 R10.1 | 21.2,53.4 21.2,53.5 22.5,53.5 v22.8,53.2 | 21.2,53.4 21.2,49.7 22.45,48.45 | 22.45,48.45 22.5,48.4 22.5,45 21.7,44.2 v20.5,44.2 v18.8,45.9 | v27.3,61.4 27.3,53.8 27.1,53.6 27.1,52.6 v27.6,52.1 26.4,50.9 v23,50.9 22.45,50.35 22.45,48.45 | v37.6,50.8 36.7,50.8 35.7,51.8 v35.7,52.6 | C1.1 29.03,71.7 27.8,71.7 27.8,71.1 v27.5,70.8 27.4,70.7 v27.4,68.8 | 14.3,43.3 17,43.3 v17.9,42.4 | U1.38 48.62,71.5 v52.3,71.5 53.3,71.5 v53.6,71.8 | 21.2,53.4 17.8,50 v17.8,48.5 | v24.3,29 24.3,26.6 v25.6,25.3
  Top 0.305: D1.2 D1.5 42.43,8.63 USB1.T2 | J3.GND 66.07,47.27 64.8,46 64.8,45.8 C9.1 | v54.3,19.9 55.4,19.9 57,18.3 | v55.1,41.4 55.23,41.53 U5.P$4
  Top 0.406: USB1.5 41.3,2.87 USB1.T5 | U2.2 34.44,10.34 34.9,10.8 34.9,12.55 C7.1 | USB1.T3 36.41,2.91
  Top 0.508: 28.55,18.95 28,19.5 28,21.3 28.6,21.9 28.61,21.89 C4.1
  Top 0.813: C1.1 31.27,71.52 U1.1 40.5,71.39 | IC1.1 31.66,21.89 C4.1 | C3.1 28.55,18.95 | U1.38 42.9,71.39 40.5,71.39 | U1.39 38.91,68.2 | 38.91,68.2 38.91,69.79 40.5,71.39 | v37.3,68.2 38.91,68.2 | USB1.T4 USB1.T5 USB1.T6 42.43,3.9 USB1.T2
  Top 1.016: USB1.T6 44.69,3.8 45.8,3.8 v45.8,4.9 | USB1.T3 31.88,2.72 31.45,3.15 31.45,3.25 v32.6,4.4
  Top 1.27: J12.GND 20.12,59.12 14.3,53.3 | J11.GND 12.66,53.3 14.3,53.3 | J10.GND 12.45,41.45 13.7,42.7 | 14.3,53.3 14.3,43.3 13.7,42.7 | J9.GND 12.33,28.43 13.7,29.8 | 13.7,29.8 13.7,42.7 | J8.GND 19.48,17.48 20.1,18.1 20.1,20.3 17.8,22.6 17.8,28.1 16.1,29.8 13.7,29.8 | J6.GND 56.2,17.5 57,18.3 58.41,19.71 58.45,19.71 60.3,21.55 60.3,21.6 62.1,23.4 64.81,23.4 | 64.81,23.4 J5.GND | J4.GND 67.99,34.19 | 64.81,23.4 64.6,23.61 64.6,30.8 67.99,34.19 | 67.99,34.19 67.5,34.69 67.5,45.1 69.67,47.27 J3.GND 70.66,47.81 70.33,48.14 70.33,48.47 69.2,49.6 66.8,49.6 63.4,53 63.4,57.53 J2.GND 63.57,60.8 58,60.8 53.8,65 53.8,66.2 55.03,67.43 J1.GND
  Bottom 0.152: v19.6,37.9 19.6,40.4 19.7,40.5 v19.7,42 20.5,42.8 v20.5,44.2 | C5.1 37.56,60.34 | C6.1 37.28,56.68 37.7,57.1 | 37.56,60.34 37.7,60.2 37.7,57.1 | 37.7,57.1 39,58.4 v40.2,58.4 | v34.3,65.1 34.3,65.8 v35,66.5 36,67.5 36.4,67.5 37.1,68.2 v37.3,68.2 | v42,55.7 43.3,57 44.2,57 44.3,57.1 v44.3,58.3 | v39.6,46 35.87,46 | v37.8,36.1 37.5,35.8 v34.7,35.8 34.7,35.7 34.7,32.9 v34.6,32.8 34.3,32.5 v31,32.5 29.9,31.4 27.7,31.4 | 27.7,31.4 27.6,31.4 26.9,30.7 v26.9,30.3 | v27.7,32.3 27.7,31.4 | v52,28.3 53.8,26.5 v53.8,26.1 v56.5,26.1 | 22.2,40.4 23.8,38.8 v24.7,38.8 | 37.56,60.34 38.16,60.34 v38.5,60 | 35,46.2 35,42.5 34.7,42.2 33.3,42.2 | 18.2,34 v18.2,34.2 | v51,30.7 51,34.1 v51.6,34.7 50.6,35.7 49.9,35.7 49.3,36.3 v49.3,39.4
  Bottom 0.203: C6.1 35.76,54.26 35.2,53.7 v34.3,53.7 | v38.54,22 38.54,21.24 37.9,20.6 37.9,17.7 v38.5,17.1 | 35.87,46 35,46.2 34.8,46.9 34.8,47.4 34.6,47.9 v33.9,48.3 | v48.2,19.2 47.5,19.9 v47.5,23.2 | 47.6,60.6 v46.2,59.2 | v55.1,41.4 54.8,41.1 52.5,41.1 51.6,40.2 51.6,39.7 51.3,39.4 v49.3,39.4
  Bottom 0.254: v45.5,22.5 45.3,22.7 v40.1,22.7 | v33.2,42.3 33.3,42.2 33.4,42.1 33.4,39.07 34.5,38.44 | 34.5,35.83 34.7,35.7 | 22.2,40.4 19.8,40.4 19.7,40.5 | v26.9,30.3 26.9,27.5 28.6,25.8 v28.6,23.9 | v52.3,71.5 52.3,69.4 51.9,69 | v17.8,48.5 17.8,46.9 v18.8,45.9 | v53.6,71.8 54.03,71.8 54.26,72.03 57.47,72.03 v58.2,71.3 | v25.6,25.3 26.2,24.7 v26.2,20.5
  Bottom 0.305: J5.GND 68.15,24.1 v69.9,24.1
  Bottom 0.406: USB1.T6 USB1.T3 36.8,3.12 36.8,4.4 37.58,5.18 USB1.T1 | J12.GND 20.12,66.18 19.3,67 19.3,69.3 22.11,72.11 27.19,72.11 27.8,71.5 27.5,71.2 v27.5,70.8
  Bottom 0.813: C0.1 36.83,68.67 v37.3,68.2
  Bottom 1.016: USB1.T3 34.73,4.4 v32.6,4.4 | USB1.T2 43.98,5.72 44.8,4.9 v45.8,4.9 45.8,2.8 45.7,2.7 45.68,2.72 USB1.T6 | 52.7,68.5 52.4,68.5 51.9,69 50.69,70.21 C0.1
  Bottom 1.27: v32.6,4.4 32.6,8.42 30.69,10.33 29.09,10.33 J7.GND 29.4,10.72 29.4,13.6 28.2,14.8 25,14.8 22.32,17.48 J8.GND | J1.GND 54.65,68.14 54.05,68.14 53.69,68.5 52.7,68.5
  pour Bottom (rank 2, no thermals): 34.92,1.27 34.92,4.45 36.2,4.45 36.2,6.99 43.81,6.99 43.81,4.45 45.09,4.45 45.09,1.27
  pour Top (rank 2, no thermals): 41.2,17.65 45.21,17.65 45.21,13.64 41.2,13.64
  pour Top (rank 2, no thermals): 41.78,66.68 41.78,60.99 36.09,60.99 36.09,66.68
  pour Bottom: 0,0 0,80.01 81.28,80.01 81.28,0
  pour Top: 35,1.3 35,4.4 36.2,4.4 36.2,6.9 43.8,6.9 43.8,4.5 43.9,4.4 45.1,4.4 45.1,1.3
  pour Top: 0,80 81.2,80 81.2,0 35,0 35,6.4 35.6,7 39,7 39.3,7.3 39.3,9.3 40.1,10.1 40.1,12.2 39.6,12.7 35.1,12.7 35,12.6 35,10.6 34.4,10 34.4,7.1 34.7,6.8 34.7,4.9 34.5,4.9 34.5,3.9 34.7,3.7 34.7,0.7 34.1,0.1 0,0.1
IO0  (via drill 0.35)
  Top 0.152: BOOT.3 BOOT.4 51.76,32.05 49.9,33.9 v49.9,34.5 | 47.12,45.9 47.1,45.9 44.8,45.9 44.4,45.5 44.4,43.4 44.1,43.1 43.42,43.1 U3.3 43.23,41.67 44.19,40.71 v44.19,39.7 | v47.6,36.8 45.2,36.8 v44.6,36.2
  Top 0.203: U1.25 49.92,54.88 50.4,54.4 50.4,53.4 50.9,52.9 50.9,48.2 49.4,46.7 47.9,46.7 47.6,46.4 47.2,46.4 47.1,46.3 47.1,45.9 | R1.7 47.42,45.6 47.12,45.9
  Bottom 0.152: v49.9,34.5 v47.6,36.8 | v44.6,36.2 44.6,37.6 44.3,37.9 44.3,39.59 v44.19,39.7
IO2  (via drill 0.35)
  Top 0.203: R1.6 48.23,45.52 v48.5,45.8 | v46.5,48.9 46.5,53 47.1,53.6 48.4,53.6 U1.24
  Bottom 0.203: v48.5,45.8 46.5,47.8 v46.5,48.9
IO32  (via drill 0.35)
  Top 0.254: U1.8 34.2,62.49 v34.9,61.8
  Bottom 0.254: X1.1 34.07,60.23 C5.2 33.95,60.85 v34.9,61.8
IO33  (via drill 0.35)
  Top 0.305: U1.9 33.02,61.23 v33.5,61.7
  Bottom 0.203: C6.2 34.28,56.68 35.4,57.8 35.81,57.8 X1.2
  Bottom 0.305: C6.2 34.03,56.8 32.6,56.8 32.6,60.8 v33.5,61.7
LED1K  (via drill 0.35)
  Top 0.152: v43,29.9 43,36.83 POW.K | v42.7,25 41.9,24.2 R10.2
  Bottom 0.152: v43,29.9 43,25.3 v42.7,25
LED2K1
  Top 0.254: R3.2 39.05,43.55 RX.K
LED2K2
  Top 0.254: R4.2 34.2,40.82 TX.K
N$1
  Top 0.152: IC2.1 41.2,16.6
  Top 0.254: IC2.1 39.66,16.64 39.6,16.7 39.6,20.5 R5.1
N$2  (via drill 0.35)
  Top 0.254: v31.5,41.4 32.2,41.9 v32.2,42.4
  Bottom 0.254: X2.1 28.6,38 28.6,40 29.5,41 30.5,41.4 v31.5,41.4 | v32.2,42.4 32.2,43.2 R11.1
N$3
  Top 0.254: IC2.17 43.7,19 44.2,19.5 44.7,19.5 44.8,19.6 R2.1
N$4
  Bottom 0.254: X2.2 28,41.6 29.3,41.6 29.9,42.2 R12.1
N$5  (via drill 0.35)
  Top 0.305: U5.P$6 60.78,43.48 60.8,43.46 60.94,43.46 61.2,43.2 v62.3,43.2
  Bottom 0.254: JMP1.3 60.4,53.4 61.5,53.4 62.3,52.6 v62.3,43.2
N$6  (via drill 0.35)
  Top 0.305: U5.P$3 53.62,43.48 v53.6,43.5
  Bottom 0.305: v53.6,43.5 53.1,44 53.1,50 JMP2.3
N$7
  Top 0.305: R16.2 R13.1 56.1,41 56.17,41.07 59.31,41.07 60.3,42.06 60.3,42.8 59.6,42.8 U5.P$5
N$8  (via drill 0.35)
  Top 0.305: R14.1 55,49.4 v55,47.1
  Bottom 0.254: 60.2,51.9 JMP1.2
  Bottom 0.305: JMP1.2 59.61,51.11 59.4,51.11 57.8,49.51 57.8,48.8 56.1,47.1 v55,47.1
N$9  (via drill 0.35)
  Top 0.305: R15.1 52.8,52.8 52.8,51.8 53.1,51.5 v55.1,51.5
  Bottom 0.305: v55.1,51.5 53.5,51.5 JMP2.2
N$10  (via drill 0.35)
  Top 0.305: 48.44,65 U1.33 50.06,65.03 50.8,64.3 50.8,63.9 52.1,62.6 52.1,54.3 51.7,53.9 51.7,50.5 52.1,50.1 R14.2 54,48.8 v54,48.3 | R6.2 57.6,50.9 v58,51.3
  Bottom 0.305: v58,51.3 55,48.3 v54,48.3
N$11
  Top 0.305: R16.1 TP7.TP
N$12
  Top 0.305: 48.45,68.8 U1.36 48.55,68.8 50.7,68.8 50.9,68.6 50.9,65.2 52.8,63.3 52.8,56 53.9,54.9 54.1,54.9 54.3,54.7 54.3,54.2 | 54.3,54.2 R15.2 | R7.2 57.5,53.9 57.3,54.1 54.4,54.1 54.3,54.2
RTS  (via drill 0.35)
  Top 0.152: v42.21,19.7 v42.2,19.71 | v41.6,41.8 41.73,41.93 U3.1 41.73,43.53 41.8,43.6 42.1,43.6 42.48,43.98 U3.5
  Top 0.254: IC2.19 42.7,19.21 v42.21,19.7
  Bottom 0.152: v42.2,19.71 42.2,21.2 41.6,21.8 39.5,21.8 39.3,22 39.3,27.3 40.6,28.6 40.6,40.8 v41.6,41.8
RXD  (via drill 0.35)
  Top 0.254: R2.2 48.3,20.6 48.5,20.8 TP4.TP 48.5,24.4 v48.1,24.8 | v45.2,48.7 v45.2,53.6 | v46.3,66.3 48.4,66.3 U1.34
  Bottom 0.254: v48.1,24.8 48.1,35.1 44.9,38.3 44.9,48.4 v45.2,48.7 | v45.2,53.6 45.2,59.6 44.8,60 44.8,65.1 46,66.3 v46.3,66.3
RXLED  (via drill 0.35)
  Top 0.203: v47.1,27.1 47.8,26.4 49.7,26.4 50.1,26 v50.1,19.5
  Top 0.254: IC2.14 46.24,16.14 46.3,16.2 v46.3,17.2 | v46.8,33.1 45.9,33.1 43.7,35.3 43.7,37.8 41.8,39.7 38.4,39.7 37.45,40.65 R3.1
  Bottom 0.203: v46.8,33.1 47.1,32.8 v47.1,27.1 | v46.3,17.2 47.8,17.2 v50.1,19.5
SCL  (via drill 0.35)
  Top 0.254: v40.3,50.8 40.8,50.3 v40.8,48.9 | v51.8,48 51.8,46.3 53.98,44.12 U5.P$2 | J11.SCL 15.85,59.25 v17.8,61.2 | v23.2,62.2 25.39,64.39 25.39,64.67 25.9,65.18 25.9,66.7 25.1,67.5 J12.SCL | v65.9,65 64.8,65 63.1,63.3 61.11,63.3 J1.SCL | J4.SCL 68.96,28.9 67.8,28.9 v66.9,29.8 | v62.9,32.5 62.5,32.9 62.5,34.2 | 58.35,34.85 58.35,35.85 v58.5,36 58,36.5 52.7,36.5 51.8,37.4 51.8,43.3 TP2.TP | v59.1,38.7 59.1,39.8 R8.1
  Top 0.305: v51.8,48 51.8,47.6 51.1,46.9 TP2.TP 51.3,44 | 58.35,34.85 59,34.2 62.5,34.2 62.7,34.2 64.7,36.2 v64.7,39.4 | v69.2,40.5 70.67,40.5 J3.SCL
  Bottom 0.254: J4.SCL 73.2,28.53 73.2,21.3 67.8,15.9 67.4,15.9 | J5.SCL 64.01,17.63 64.02,17.7 65,17.7 66.8,15.9 67.4,15.9 | J6.SCL 52.84,8.3 59.8,8.3 67.4,15.9 | v40.8,48.9 44,48.9 44.9,49.8 51.7,49.8 51.8,49.7 | v40.3,50.8 39.2,50.8 38.3,51.7 33.2,51.7 33,51.9 29.1,51.9 27.8,53.2 27.8,57.1 28.1,57.4 28.1,64.3 27.7,64.3 26.4,65.6 26.4,66.45 J12.SCL | v51.8,48 51.8,49.7 | 51.8,49.7 51.8,53.1 52.2,53.5 JMP2.1 | v17.8,61.2 18.8,62.2 v23.2,62.2 | J11.SCL 14.62,59.6 10.1,59.6 7.2,56.7 7.2,52.1 9.26,50.04 J10.SCL 9.12,47.53 8.14,47.53 8.09,47.48 6.68,47.48 6.63,47.53 3.7,44.6 3.7,34.1 4.9,32.9 6.1,32.9 | J9.SCL 7.71,32.9 6.1,32.9 | J8.SCL 13.09,21.2 13.09,21.18 13,21.08 13,20.3 12,19.3 | 12,19.3 10.6,19.3 6,23.9 6,32.8 6.1,32.9 | 12,19.3 11.8,19.1 11.8,17.2 19.1,9.9 22.5,9.9 22.7,10.1 22.7,10.69 23.08,11.07 23.08,11.08 23.66,11.66 J7.SCL | J2.SCL 68.3,54.6 70.8,57.1 70.8,62.6 67.9,65.5 66.4,65.5 v65.9,65 | v66.9,29.8 64.2,32.5 v62.9,32.5 | v58.5,36 59.1,36.6 v59.1,38.7
  Bottom 0.305: J1.SCL 56.1,60.5 54.4,60.5 53.2,59.3 JMP2.1 | v64.7,39.4 65.8,40.5 v69.2,40.5
SD2  (via drill 0.35)
  Top 0.254: U1.17 35.2,51.1 35.9,50.5 35.9,49.9 v34.9,49.1 | v35.7,47.5 35.07,47.18 v33.9,47.26
  Bottom 0.254: v34.9,49.1 34.9,48.3 v35.7,47.5 | v33.9,47.26 33.9,46.08 32.5,45.8 31.6,45.4 31.6,44.4 R11.2
SD3  (via drill 0.35)
  Top 0.254: v28,45.7 v28,49.5 | v33.1,49.4 U1.18
  Bottom 0.254: R12.2 28.3,45.1 v28,45.7 | v28,49.5 30,47.4 33.1,47.4 v33.1,49.4
SDA  (via drill 0.35)
  Top 0.254: v54.1,61.6 55.91,59.79 58.24,59.79 59.24,58.8 59.5,58.8 60.7,57.6 v60.7,57.1 | v24.2,9.4 19.9,9.4 15.1,14.2 15.24,14.34 v15.24,15.4 | v60.2,32.4 60.2,30.3 TP1.TP | v65.7,63.8 64.9,63.8 63.1,62 62.7,62 62.3,62.4 59.8,62.4 58.35,63.85 J1.SDA
  Top 0.305: R9.1 59.4,36.1 v59.9,35.6 | v59,47.7 61,47.7 62.6,49.3 | 62.6,49.3 62.6,50.8 62.7,50.9 62.7,51 60.4,53.3 60.4,56.8 v60.7,57.1 | v64.8,48.8 63.1,48.8 62.6,49.3 | U5.P$7 61.02,44.12 v61.1,44.2 | v59.8,27.9 TP1.TP
  Bottom 0.152: J8.SDA 15.2,20.6
  Bottom 0.254: 62.2,22.5 62.2,21.93 62.61,21.51 62.61,21.21 | J5.SDA 62.06,20.66 60.3,18.9 60.3,14.4 62.45,12.25 59.6,9.4 54.45,9.4 J6.SDA | 26.4,60.6 26.4,64.1 23.86,66.64 J12.SDA | 26.4,60.6 26.4,58.7 26.6,58.5 26.6,55.4 26.1,54.9 26.1,52.1 27.7,50.5 34.6,50.5 35.2,49.9 42.6,49.9 44.8,52.1 50,52.1 50.8,52.9 50.8,59.3 53.1,61.6 v54.1,61.6 | JMP1.1 60.3,47.2 61.1,46.4 v61.1,44.2 | J11.SDA 14.67,56.8 15,56.8 | 15,56.8 18.6,56.8 22.5,60.7 26.3,60.7 26.4,60.6 | J10.SDA 11.01,45.41 11.9,46.3 | 15,56.8 15,49.4 11.9,46.3 | 11.9,46.3 12.9,45.3 12.9,32.3 12.93,32.27 | 12.93,32.27 J9.SDA | 12.93,32.27 17,28.2 17,22.1 16.81,22.1 J8.SDA 14,19.29 14,18.7 15.24,17.46 v15.24,15.4 | J7.SDA 24.2,10.87 v24.2,9.4 | v59.9,35.6 59.9,32.7 v60.2,32.4 | J4.SDA 68.43,31.9 67.5,31.9 63.45,35.95 62.55,35.95 | J2.SDA 69.5,58.12 69.5,62.4 67.6,64.3 67.1,63.8 v65.7,63.8
  Bottom 0.305: v61.1,44.2 61.1,42.3 62.7,40.7 | v59.9,35.6 62.2,35.6 62.55,35.95 62.7,36.1 62.7,40.7 | 62.7,40.7 63.9,41.9 68.3,41.9 69.71,43.31 J3.SDA | JMP1.1 59,48.8 v59,47.7 | v60.7,57.1 60.7,59.8 64.2,63.3 64.2,64.6 64.8,65.2 64.8,65.4 62.6,67.6 60.43,67.6 J1.SDA | J2.SDA 65.78,54.4 65.6,54.4 64.8,53.6 v64.8,48.8 | 62.61,21.21 62.06,20.66 | 62.2,22.5 62.2,25.2 59.8,27.6 v59.8,27.9
TXD  (via drill 0.35)
  Top 0.254: R5.2 42.5,20.6 42.9,21 42.9,21.9 | 42.9,21.9 42.9,22 TP3.TP | U1.35 45.88,67.58 43.7,65.4 43.7,62.2 43.5,62 43.5,56.4 43.9,56 43.9,53.6 42.9,53.1 42.9,51.9 43.5,51.1 43.5,49.4 42.5,48.6 v42.5,46.7 | v44.2,26 43.7,25.5 43.7,22.7 42.9,21.9
  Bottom 0.254: v44.2,26 44.2,26.6 45,27.4 45,31.5 43.4,33.1 43.5,41.4 43.1,42.8 43.1,46 v42.5,46.7
TXLED  (via drill 0.35)
  Top 0.152: IC2.7 42.7,12.9 42.6,12.8 41.09,12.8 39.7,14.2 37.4,14.2 37,14.6 v37,15.1
  Top 0.254: R4.1 32.66,30.84 34,29.5 34,29.3 34.9,29.3 v35,29.2
  Bottom 0.254: v35,29.2 35.6,28.6 35.6,27.7 37,26.3 v37,15.1
USBDM  (via drill 0.35)
  Top 0.254: IC2.9 43.7,13.08 44.38,12.4 46.2,12.4 48.3,14.5 v48.3,16.6 | v39,13.4 40.5,11.9 40.5,11.4
  Top 0.305: USB1.2 39.4,5.57 39.4,8.9 40.5,10 40.5,11.4 40.9,11.8 41.4,11.8 41.4,11.2 D1.3
  Bottom 0.254: v48.3,16.6 46.9,16.6 43.7,13.4 v39,13.4
USBDP  (via drill 0.35)
  Top 0.152: IC2.8
  Top 0.305: D1.4 40.68,7.82 | 40.68,7.82 40.45,7.6 40.2,7.6 40.01,7.41 USB1.3 | IC2.8 43.2,12.89 44.4,11.7 45.7,11.7 46.3,11.1 v46.3,6.8 | v40.2,8.4 40.68,7.92 40.68,7.82
  Bottom 0.305: v46.3,6.8 44.8,8.3 40.3,8.3 v40.2,8.4
USBVBUS  (via drill 0.35)
  Top 0.305: D1.1 43.5,11 44.8,11 45,10.8 v45,6.7 | v37.1,7.8 38,8.7 38.4,8.7
  Top 0.508: USB1.1 38.7,8.1 | 38.7,8.1 38.7,8.39 38.4,8.7 37.7,9.4 U2.4 | U2.5 37.41,11.29 38.7,10 38.7,8.11 38.7,8.1
  Bottom 0.305: v37.1,7.8 37.4,7.5 44.2,7.5 v45,6.7
  pour Top: 34.9,7.4 38.7,7.4 38.7,9.3 39.6,10.2 39.6,11.9 39.2,12.3 35.6,12.3 35.4,12.1 35.4,10.2 34.9,9.7

### Text on the board
tPlace: 3V3
bPlace: MADE IN JAPAN | ESP32 WROVER DevBoard | Rev.0.6